# EAGLE design sensorconductivity (EAGLE 7.2.0)
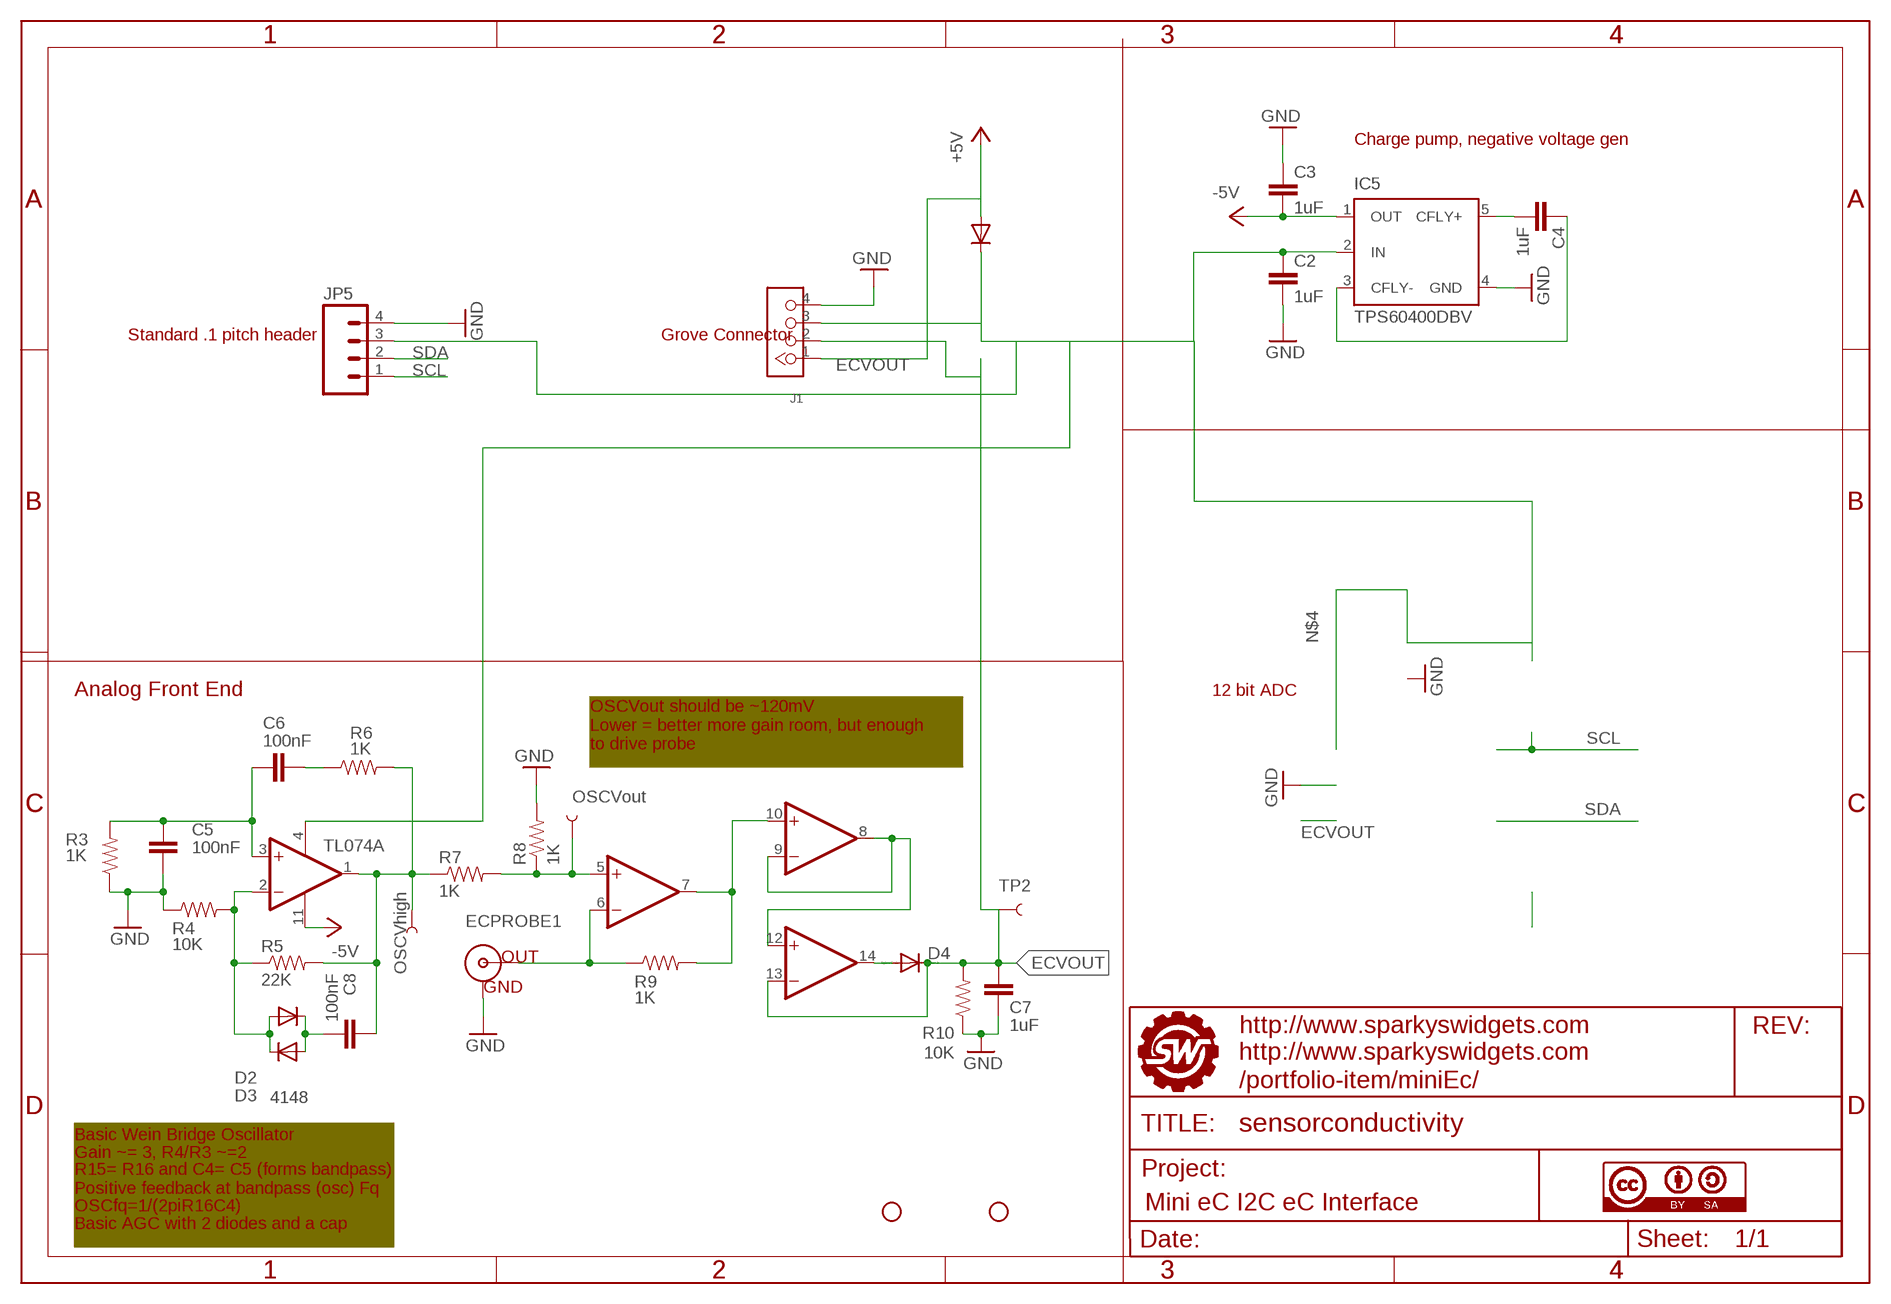
[diagram p0: schematic, sheet 1]

## Parts
C2  1uF  CAP0805  [0805]
C3  1uF  CAP0805  [0805]
C4  1uF  CAP0805  [0805]
C5  100nF  CAP0805  [0805]
C6  100nF  CAP0805  [0805]
C7  1uF  CAP0805  [0805]
C8  100nF  CAP0805  [0805]
D1  4148  MBR0520LT  [SOD123]
D2  4148  MBR0520LT  [SOD123]
D3  4148  MBR0520LT  [SOD123]
D4  DIODE-SMB  [SMB]
ECPROBE1  BNCPTH  [BNC]
IC5  TPS60400DBV  [SOT23-DBV]
J1  TWIG-4P-2.0-2.0  [4P-2.0]
JP1  STAND-OFF  [STAND-OFF]
JP3  STAND-OFF  [STAND-OFF]
JP5  M04PTH  [1X04]
R3  1K  RESISTOR0805-RES  [0805]
R4  10K  RESISTOR0805-RES  [0805]
R5  22K  RESISTOR0805-RES  [0805]
R6  1K  RESISTOR0805-RES  [0805]
R7  1K  RESISTOR0805-RES  [0805]
R8  1K  RESISTOR0805-RES  [0805]
R9  1K  RESISTOR0805-RES  [0805]
R10  10K  RESISTOR0805-RES  [0805]
TL074  TL074  QUADOPAMPM  [SO14]
TP2  TEST-POINT3  [PAD.03X.03]
TP3  OSCVhigh  TEST-POINT3  [PAD.03X.03]
TP5  OSCVout  TEST-POINT3  [PAD.03X.03]
U$4  FRAME_MINIEC  [SWPCBLOGOWITHINFO]
U$5  CC-BY-SA  [CC-BY-SA]

## Nets
+5V: D1.A J1.1
-5V: C3.2 IC5.1(OUT) TL074.11(P:V-)
ECVOUT: C7.2 D4.C J1.2 R10.2 TL074.13(D:-IN) TP2.P$1
GND: C2.2 C3.1 C5.1 C7.1 ECPROBE1.GND IC5.4(GND) J1.4 JP5.4 R3.1 R4.1 R8.2 R10.1
N$1: C8.2 D2.C D3.A
N$4: C2.1 D1.C IC5.2(IN) J1.3 JP5.3 TL074.4(P:V+)
N$22: C4.1 IC5.3(CFLY-)
N$23: C4.2 IC5.5(CFLY+)
N$30: C5.2 C6.2 R3.2 TL074.3(A:+IN)
N$31: D2.A D3.C R4.2 R5.1 TL074.2(A:-IN)
N$32: C6.1 R6.1
N$33: C8.1 R5.2 R6.2 R7.1 TL074.1(A:OUT) TP3.P$1
N$34: R7.2 R8.1 TL074.5(B:+IN) TP5.P$1
N$35: ECPROBE1.S(OUT) R9.1 TL074.6(B:-IN)
N$36: R9.2 TL074.7(B:OUT) TL074.10(C:+IN)
N$39: TL074.8(C:OUT) TL074.9(C:-IN) TL074.12(D:+IN)
N$41: D4.A TL074.14(D:OUT)
SCL: JP5.1
SDA: JP5.2

## Notes on the sheet
- Charge pump, negative voltage gen
- Standard .1 pitch header | Grove Connector
- Analog Front End | 12 bit ADC
- OSCVout should be ~120mV
  Lower = better more gain room, but enough
  to drive probe
- Basic Wein Bridge Oscillator
- Gain ~= 3, R4/R3 ~=2
- R15= R16 and C4= C5 (forms bandpass)
  Positive feedback at bandpass (osc) Fq
- OSCfq=1/(2piR16C4)
- Basic AGC with 2 diodes and a cap

## Library data of the parts
C2-C8 = SparkysWidgets:CAP: Capacitor Standard 0603 ceramic capacitor, and 0.1" leaded capacitor.
D1-D3 = SparkysWidgets:MBR0520LT: SCHOTTKY BARRIER RECTIFIER Source: http://onsemi.com .. MBR0520LT1-D.pdf
D4 = diode:DIODE-: DIODE
ECPROBE1 = SparkysWidgets:BNC: BNC Connector, Mouser Part# 5227161
IC5 = SparkysWidgets:TPS60400DBV: UNREGULATED CHARGE PUMP VOLTAGE INVERTER 60-mA unregultated charge pump voltage inverter Source: http://focus.ti.com/lit/ds/symlink/tps6040i.pdf
J1 = Connector:TWIG-4P-2.0
JP1 JP3 = SparkFun:STAND-OFF: Stand Off This is the mechanical footprint for a #4 phillips button head screw. Use the keepout ring to avoid running the screw head into surrounding components. SKU : PRT-00447
JP5 = SparkFun:M04: Header 4 Standard 4-pin 0.1" header. Use with straight break away headers (SKU : PRT-00116), right angle break away headers (PRT-00553), swiss pins (PRT-00743), machine pins (PRT-00117), and female headers (PRT-00115). Molex polarized connector foot print use with SKU : PRT-08231 with associated crimp pins and housings. 1MM SMD Version SKU: PRT-10208
R3-R10 = SparkysWidgets:RESISTOR: Resistor Basic schematic elements and footprints for 0603, 1206, and PTH resistors.
TL074 = SW_DigitalAnalogICs:QUADOPAMP: Quad General Purpose, Low Voltage, Rail-to-Rail Output Operational Amplifiers Source: http://www.national.com/mpf/LM/LMV321.html http://www.national.com/dt/lmv_qual.pdf
TP2 TP3 TP5 = SW_Passives:TEST-POINT: Bare copper test points for troubleshooting or ICT
U$4 = SW_ArtWork:FRAME_MINIEC: A4 Sparky's Widgets frame This is a standard A4 Frame, the Doc Field has been modified with our Logo and contains the license and extra project information!; PROJECT: Mini eC I2C eC Interface; URL1: /portfolio-item/miniEc/; URLHOME: http://www.sparkyswidgets.com; URLPROJECT: http://www.sparkyswidgets.com
U$5 = SparkysWidgets:CC-BY-SA

## Board
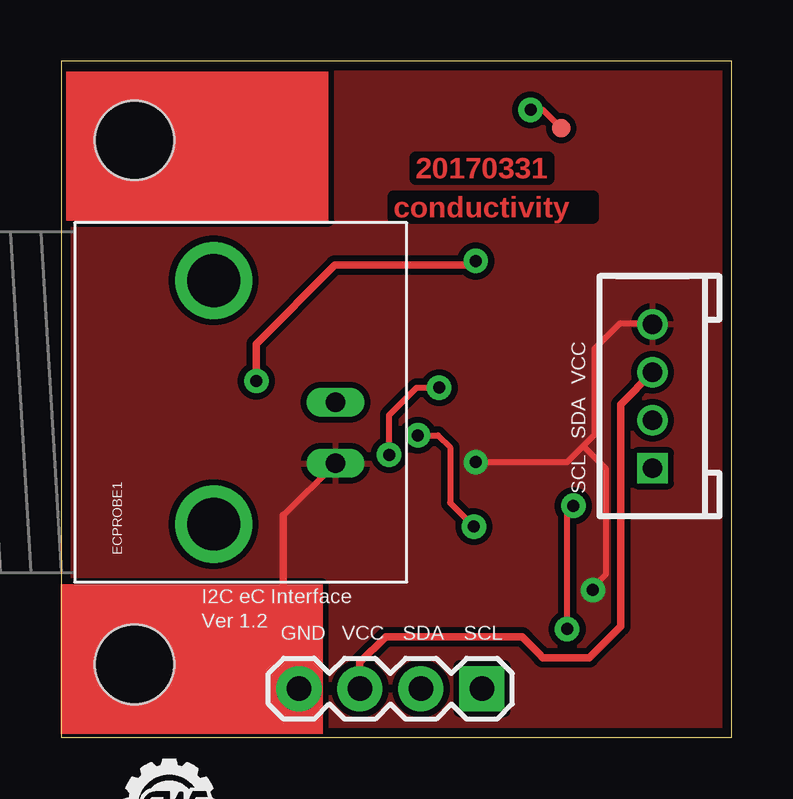
[diagram p1: board, top side]
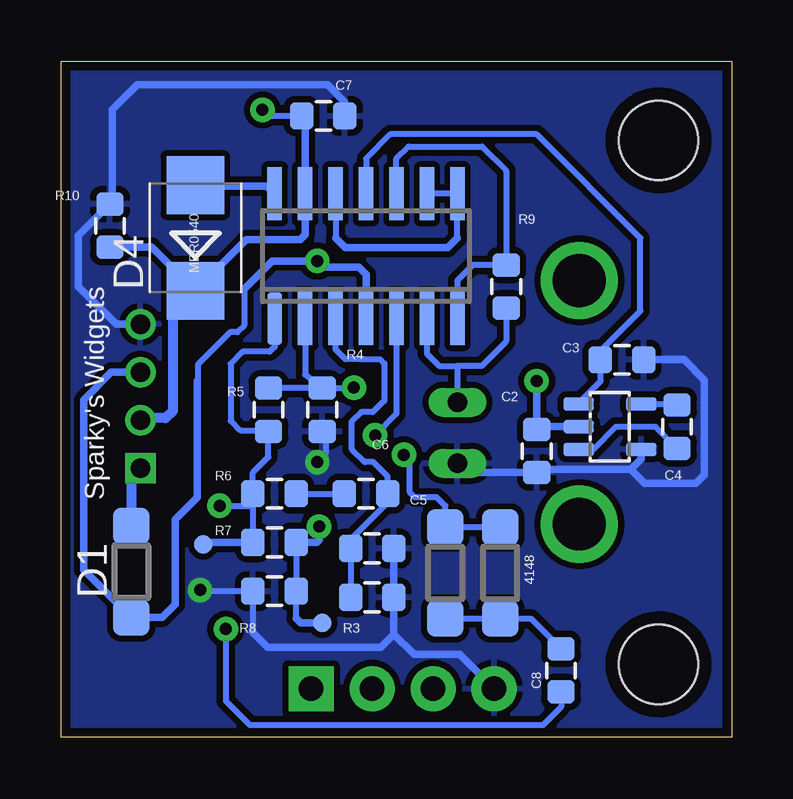
[diagram p2: board, bottom side, seen from below]

Size 27.94 x 28.19 mm. Coordinates in mm from the lower left corner, seen from the top.
Outline: 0,0 27.94,0 27.94,28.19 0,28.19 0,0
Copper layers (1*16): Top 0.0356mm / dielectric 1.5011mm / Bottom 0.0356mm
Design rules "LaenPCBOrder": minimum track width 6mil, minimum drill 13mil, track to track 6mil, track to pad 6mil, pad to pad 6mil, via to via 6mil, smd to smd 6mil, copper to edge 15mil, drill to drill 6mil, minimum pad ring 7mil, minimum via ring 7mil, stop-mask expansion 4mil, vias tented up to drill 0mil, thermal gap 10mil

### Footprints (pad centres in the part's own frame; a part is rotated, then mirrored left to right if it is on the bottom)
0805 = smd 0.984 x 1.143: 1 -0.9,0; 2 0.9,0
SOD123 = smd 1.524 x 1.524: A 1.9,0; C -1.9,0
SMB = smd 2.4 x 2.4: A 2.2,0; C -2.2,0
BNC = drill 2.2: 3 -5.08,5.08; 4 5.08,5.08 | drill 0.8 long: GND -2.54,0; S 0,0
SOT23-DBV = smd 0.55 x 1.27: 1 -0.95,-1.3; 2 0,-1.3; 3 0.95,-1.3; 4 0.95,1.3; 5 -0.95,1.3
4P-2.0 = drill 0.8 pad 1.27 square: 1 -3,0 | drill 0.8 pad 1.27: 2 -1,0; 3 1,0; 4 3,0
STAND-OFF = hole 3.302: 0,0
1X04 = drill 1.016 pad 1.88 square: 1 0,0 | drill 1.016 pad 1.88: 2 2.54,0; 3 5.08,0; 4 7.62,0
SO14 = smd 0.6 x 2.2: 1 -3.81,-2.6; 2 -2.54,-2.6; 3 -1.27,-2.6; 4 0,-2.6; 5 1.27,-2.6; 6 2.54,-2.6; 7 3.81,-2.6; 8 3.81,2.6; 9 2.54,2.6; 10 1.27,2.6; 11 0,2.6; 12 -1.27,2.6; 13 -2.54,2.6; 14 -3.81,2.6
PAD.03X.03 = smd 0.762 x 0.762: P$1 0,0

### Placement (x,y rotation side)
C2  8.13,11.94 270 bottom
C3  4.57,15.75 180 bottom
C4  2.29,12.95 90 bottom
C5  14.99,7.87 180 bottom
C6  15.24,10.16 0 bottom
C7  17.02,25.91 180 bottom
C8  7.11,2.79 90 bottom
D1  25.02,6.91 90 bottom
D2  11.94,6.86 90 bottom
D3  9.65,6.86 270 bottom
D4  22.35,20.83 90 bottom
ECPROBE1  11.43,13.97 90 top
IC5  5.08,12.95 270 bottom
J1  24.64,14.22 90 top
JP1  3.05,3.05 0 top
JP3  3.05,24.89 0 top
JP5  17.53,2.03 180 top
R3  14.99,5.84 180 bottom
R4  17.07,13.67 90 bottom
R5  19.3,13.67 270 bottom
R6  19.05,10.16 180 bottom
R7  19.05,8.13 0 bottom
R8  19.05,6.1 180 bottom
R9  9.4,18.8 90 bottom
R10  25.91,21.34 270 bottom
TL074  15.24,20.07 0 bottom
TP2  20.83,25.4 0 top
TP3  22.02,8.05 0 bottom
TP5  17.07,4.78 0 bottom
U$4  2.54,-4.83 0 top  (outside the outline)
U$5  3.05,-10.92 0 top  (outside the outline)

### Tracks (layer width: path | path; a pad name or v marks a point on that pad's centre or on a via)
+5V
  Bottom 0.406: J1.1 25.02,11.22 D1.A
-5V
  Bottom 0.254: IC5.1 6.38,13.94 5.47,14.85 C3.2 5.47,16.12 3.81,17.78 3.81,20.83 8.13,25.15 14.22,25.15 15.24,24.13 TL074.11
ECVOUT  (via drill 0.5 pad 1.02)
  Top 0.254: v19.56,26.16 20.07,26.16 TP2.P$1
  Bottom 0.254: C7.2 19.3,25.91 v19.56,26.16
  Bottom 0.305: C7.2 17.78,25.77 TL074.13 17.78,20.95 17.98,20.75 20.23,20.75 D4.C | D4.C 23.29,18.63 | R10.2 24.16,20.44 D4.C
  Bottom 0.406: 23.29,18.63 23.29,13.61 23.6,13.31 24.55,13.31 J1.2
GND  (via drill 0.5 pad 1.02)
  Top 0.254: J1.4 24.59,17.27 23.29,17.27 22.23,16.2 22.23,12.62 21.75,12.15 | 9.25,9.25 ECPROBE1.GND | v17.27,11.48 21.08,11.48 21.36,11.76 21.75,12.15 | v22.15,6.15 22.15,6.25 22.71,6.81 22.71,11.2 21.75,12.15
  Top 0.305: 9.25,9.25 9.25,2.69 JP5.4
  Bottom 0.254: R4.1 16.93,12.31 16.93,11.82 v17.27,11.48 | v22.15,6.15 22.1,6.1 R8.2 19.95,4.38
  Bottom 0.305: IC5.4 3.78,11.61 4.22,11.18 | 4.22,11.18 7.99,11.18 C2.2 11.04,11.04 ECPROBE1.GND | C3.1 1.98,15.75 1.14,14.91 1.14,10.95 1.5,10.59 3.63,10.59 4.22,11.18 | C5.1 R3.1 14.09,4.31 | 14.09,4.31 13.23,3.45 11.33,3.45 JP5.4 | J1.4 25.66,17.22 27.23,18.8 27.23,20.91 R10.1 25.81,22.34 25.81,26.16 24.77,27.2 16.84,27.2 16.12,26.48 C7.1 | 19.95,4.38 19.33,3.76 14.63,3.76 14.09,4.31
  pour Top (isolate 0.254): -0.03,-0.05 27.99,-0.05 27.99,28.24 -0.05,28.24 -0.05,-0.05
  pour Bottom (isolate 0.254): -0.08,-0.1 28.04,-0.1 28.04,28.3 -0.08,28.3
N$1
  Bottom 0.254: D2.C D3.A 8.38,4.96 C8.2
N$2
  Top 0.051: 0,0 27.94,0 27.94,28.19 0,28.19 0,0
N$4  (via drill 0.5 pad 1.02)
  Top 0.305: v17.27,19.86 17.09,19.68 12.37,19.68 11.4,19.68 8.13,16.41 8.13,16.15 v8.13,14.86 | JP5.3 12.45,3.12 13.51,4.19 19.2,4.19 19.3,4.09 19.91,3.48 20.07,3.33 22,3.33 23.3,4.64 23.3,5.42 23.3,13.89 J1.3
  Bottom 0.254: 20.32,18.69 20.32,17.17 20.6,16.89 20.9,16.89 22.25,15.54 22.25,14.88 22.28,14.86
  Bottom 0.305: IC5.2 8.01,12.95 C2.1 v8.13,14.86 | 24.6,15.19 J1.3 25.85,15.22 27,14.07 27,6.99 D1.C 23.72,5 23.19,5.54 23.19,9.09 22.28,10.01 22.28,14.86 | TL074.4 15.24,19.3 15.54,19.61 16.97,19.61 17.22,19.86 v17.27,19.86 19.15,19.86 20.32,18.69
N$22
  Bottom 0.254: IC5.3 5.78,12 4.83,12.95 3.19,12.95 C4.1
N$23
  Bottom 0.254: IC5.5 2.34,13.9 C4.2
N$30
  Bottom 0.254: R3.2 C5.2 16,8.01 16,8.13 14.48,9.65 14.48,10.02 C6.2 | C6.2 14.34,10.04 | C6.2 14.34,10.89 14.61,11.15 14.94,11.48 15.29,11.48 15.82,12.01 15.82,13.18 15.44,13.56 14.96,13.56 14.48,14.05 14.48,15.6 14.66,15.77 15.49,15.77 16.1,15.77 16.51,16.18 TL074.3
N$31  (via drill 0.5 pad 1.02)
  Top 0.254: v13.66,11.79 13.66,13.08 13.66,13.44 14.81,14.58 v15.75,14.58
  Bottom 0.254: TL074.2 17.78,15.12 R4.2 | R4.2 R5.1 | D3.C D2.A 11.94,9.65 12.29,10.01 13.21,10.01 13.41,10.21 13.41,11.53 v13.66,11.79 | R4.2 15.76,14.56 v15.75,14.58
N$32
  Bottom 0.254: R6.1 C6.1
N$33  (via drill 0.5 pad 1.02)
  Top 0.254: v21.08,4.52 21.08,9.4 v21.34,9.65
  Bottom 0.254: TL074.1 19.05,16.26 19.07,16.26 19.25,16.08 20.37,16.08 20.88,15.57 20.88,13.21 20.47,12.8 19.34,12.8 R5.2 19.3,11.68 19.95,11.04 R6.2 19.95,9.65 | 19.95,9.65 R7.1 19.95,8.27 | C8.1 7.11,1.27 7.87,0.51 20.07,0.51 21.08,1.52 v21.08,4.52 | v21.34,9.65 19.95,9.65
  Bottom 0.305: R7.1 21.95,8.13 TP3.P$1
N$34  (via drill 0.5 pad 1.02)
  Top 0.254: v14.86,12.6 15.7,12.6 16.2,12.09 16.2,9.78 v17.2,8.79
  Bottom 0.254: R7.2 R8.1 18.15,5.98 | 18.15,4.96 18.15,5.98 | 18.15,5.98 18.03,6.1 | TL074.5 13.97,15.85 13.97,13.49 v14.86,12.6 14.53,12.93
  Bottom 0.305: TP5.P$1 17.96,4.78 18.15,4.96 | R7.2 17.3,8.13 17.2,8.23 v17.2,8.79
N$35
  Bottom 0.254: R9.1 9.4,16.51 10.41,15.49 11.43,15.49 | 11.43,15.49 ECPROBE1.S | TL074.6 12.7,16 12.19,15.49 11.43,15.49
N$36
  Bottom 0.254: TL074.10 13.97,24.13 13.46,24.64 10.41,24.64 9.4,23.62 R9.2 10.78,19.7 11.43,19.05 TL074.7
N$39
  Bottom 0.254: TL074.12 16.51,20.83 | 11.43,20.83 TL074.8 TL074.9
  Bottom 0.305: 11.43,20.83 11.84,20.42 16.1,20.42 16.51,20.83
N$41
  Bottom 0.305: TL074.14 19.37,22.98 22.31,22.98 D4.A
(copper drawn outside any net)
  shapes: Top area x2

### Text on the board
Top: 20170331 | conductivity
tPlace: VCC | SDA | SCL | I2C eC Interface | Ver 1.2 | GND | VCC | SDA | SCL
bPlace: MBR0540 | Sparky's Widgets | 4148